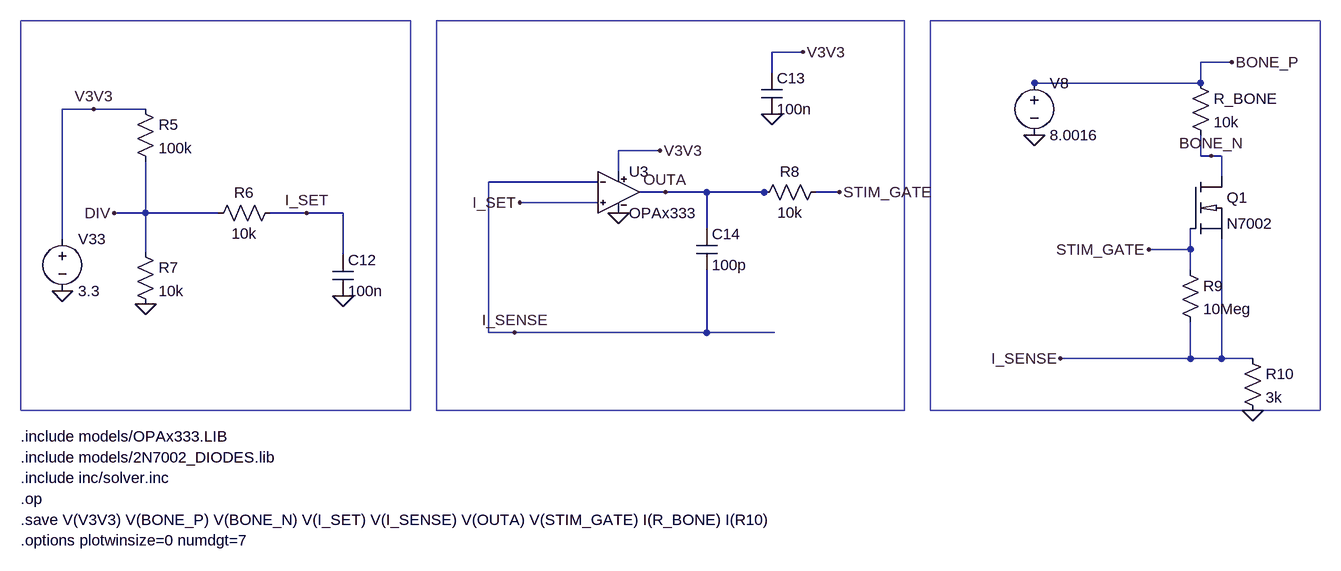
[diagram p0: schematic sink_vendor.asc]
sink_vendor.asc, the LTspice schematic file:
Version 4.1
SHEET 1 2100 900
RECTANGLE Normal 100 100 700 700
SYMBOL res 276 220 R0
SYMATTR InstName R5
SYMATTR Value 100k
SYMBOL res 276 440 R0
SYMATTR InstName R7
SYMATTR Value 10k
WIRE 292 316 292 396
WIRE 292 396 292 456
WIRE 292 396 244 396
FLAG 244 396 DIV
FLAG 292 536 0
SYMBOL voltage 164 420 R0
SYMATTR InstName V33
SYMATTR Value 3.3
WIRE 164 436 164 236
WIRE 164 236 292 236
FLAG 164 516 0
FLAG 212 236 V3V3
SYMBOL res 500 380 R90
WINDOW 0 0 56 VBottom 2
WINDOW 3 32 56 VTop 2
SYMATTR InstName R6
SYMATTR Value 10k
WIRE 292 396 404 396
SYMBOL cap 580 460 R0
SYMATTR InstName C12
SYMATTR Value 100n
WIRE 484 396 596 396
WIRE 596 396 596 460
FLAG 540 396 I_SET
FLAG 596 524 0
RECTANGLE Normal 740 100 1460 700
SYMBOL OPAx333 1020 300 R0
SYMATTR InstName U3
SYMATTR Value OPAx333
WIRE 988 380 868 380
FLAG 868 380 I_SET
WIRE 1020 332 1020 300
WIRE 1020 300 1084 300
FLAG 1084 300 V3V3
FLAG 1020 396 0
SYMBOL cap 1240 180 R0
SYMATTR InstName C13
SYMATTR Value 100n
WIRE 1256 180 1256 148
WIRE 1256 148 1304 148
FLAG 1304 148 V3V3
FLAG 1256 244 0
WIRE 1052 364 1156 364
WIRE 1156 364 1244 364
FLAG 1092 364 OUTA
SYMBOL cap 1140 420 R0
SYMATTR InstName C14
SYMATTR Value 100p
WIRE 1156 364 1156 420
WIRE 1156 484 1156 580
SYMBOL res 1340 348 R90
WINDOW 0 0 56 VBottom 2
WINDOW 3 32 56 VTop 2
SYMATTR InstName R8
SYMATTR Value 10k
WIRE 1244 364 1244 364
WIRE 1324 364 1360 364
FLAG 1360 364 STIM_GATE
WIRE 988 348 820 348
WIRE 820 348 820 580
WIRE 820 580 1156 580
WIRE 1156 580 1260 580
FLAG 860 580 I_SENSE
RECTANGLE Normal 1500 100 2100 700
SYMBOL res 1900 180 R0
SYMATTR InstName R_BONE
SYMATTR Value 10k
WIRE 1916 196 1916 164
WIRE 1916 164 1964 164
FLAG 1964 164 BONE_P
SYMBOL N7002 1900 340 R0
SYMATTR InstName Q1
SYMATTR Value N7002
WIRE 1916 276 1916 308
WIRE 1916 308 1948 308
WIRE 1948 308 1948 340
FLAG 1932 308 BONE_N
WIRE 1900 420 1900 452
WIRE 1900 452 1836 452
FLAG 1836 452 STIM_GATE
SYMBOL res 1884 468 R0
SYMATTR InstName R9
SYMATTR Value 10Meg
WIRE 1900 452 1900 484
WIRE 1900 564 1900 620
WIRE 1948 436 1948 620
SYMBOL res 1980 604 R0
SYMATTR InstName R10
SYMATTR Value 3k
FLAG 1996 700 0
WIRE 1700 620 1900 620
WIRE 1900 620 1948 620
WIRE 1948 620 1996 620
FLAG 1700 620 I_SENSE
SYMBOL voltage 1660 180 R0
SYMATTR InstName V8
SYMATTR Value 8.0016
WIRE 1660 196 1660 196
WIRE 1660 196 1916 196
FLAG 1660 276 0
TEXT 100 740 Left 2 !.include models/OPAx333.LIB
TEXT 100 772 Left 2 !.include models/2N7002_DIODES.lib
TEXT 100 804 Left 2 !.include inc/solver.inc
TEXT 100 836 Left 2 !.op
TEXT 100 868 Left 2 !.save V(V3V3) V(BONE_P) V(BONE_N) V(I_SET) V(I_SENSE) V(OUTA) V(STIM_GATE) I(R_BONE) I(R10)
TEXT 100 900 Left 2 !.options plotwinsize=0 numdgt=7

The netlist it stands for:
* sink_vendor.asc
R5 V3V3 DIV 100k
R7 DIV 0 10k
V33 V3V3 0 3.3
R6 I_SET DIV 10k
C12 I_SET 0 100n
X§U3 OPAx333
C13 V3V3 0 100n
C14 OUTA I_SENSE 100p
R8 STIM_GATE OUTA 10k
R_BONE BONE_P BONE_N 10k
X§Q1 BONE_N STIM_GATE I_SENSE N7002  ; pins D G S
R9 STIM_GATE I_SENSE 10Meg
R10 I_SENSE 0 3k
V8 BONE_P 0 8.0016
.include models/OPAx333.LIB
.include models/2N7002_DIODES.lib
.include inc/solver.inc
.op
.save V(V3V3) V(BONE_P) V(BONE_N) V(I_SET) V(I_SENSE) V(OUTA) V(STIM_GATE) I(R_BONE) I(R10)
.options plotwinsize=0 numdgt=7
.backanno
.end